# EasyEDA schematic Project Espro.json
TITLE: Project Espro; REV: 1.0; Date: 2024-11-20; Sheet: 1/1; Drawn By: Keven Hu; Company: Keven Hu
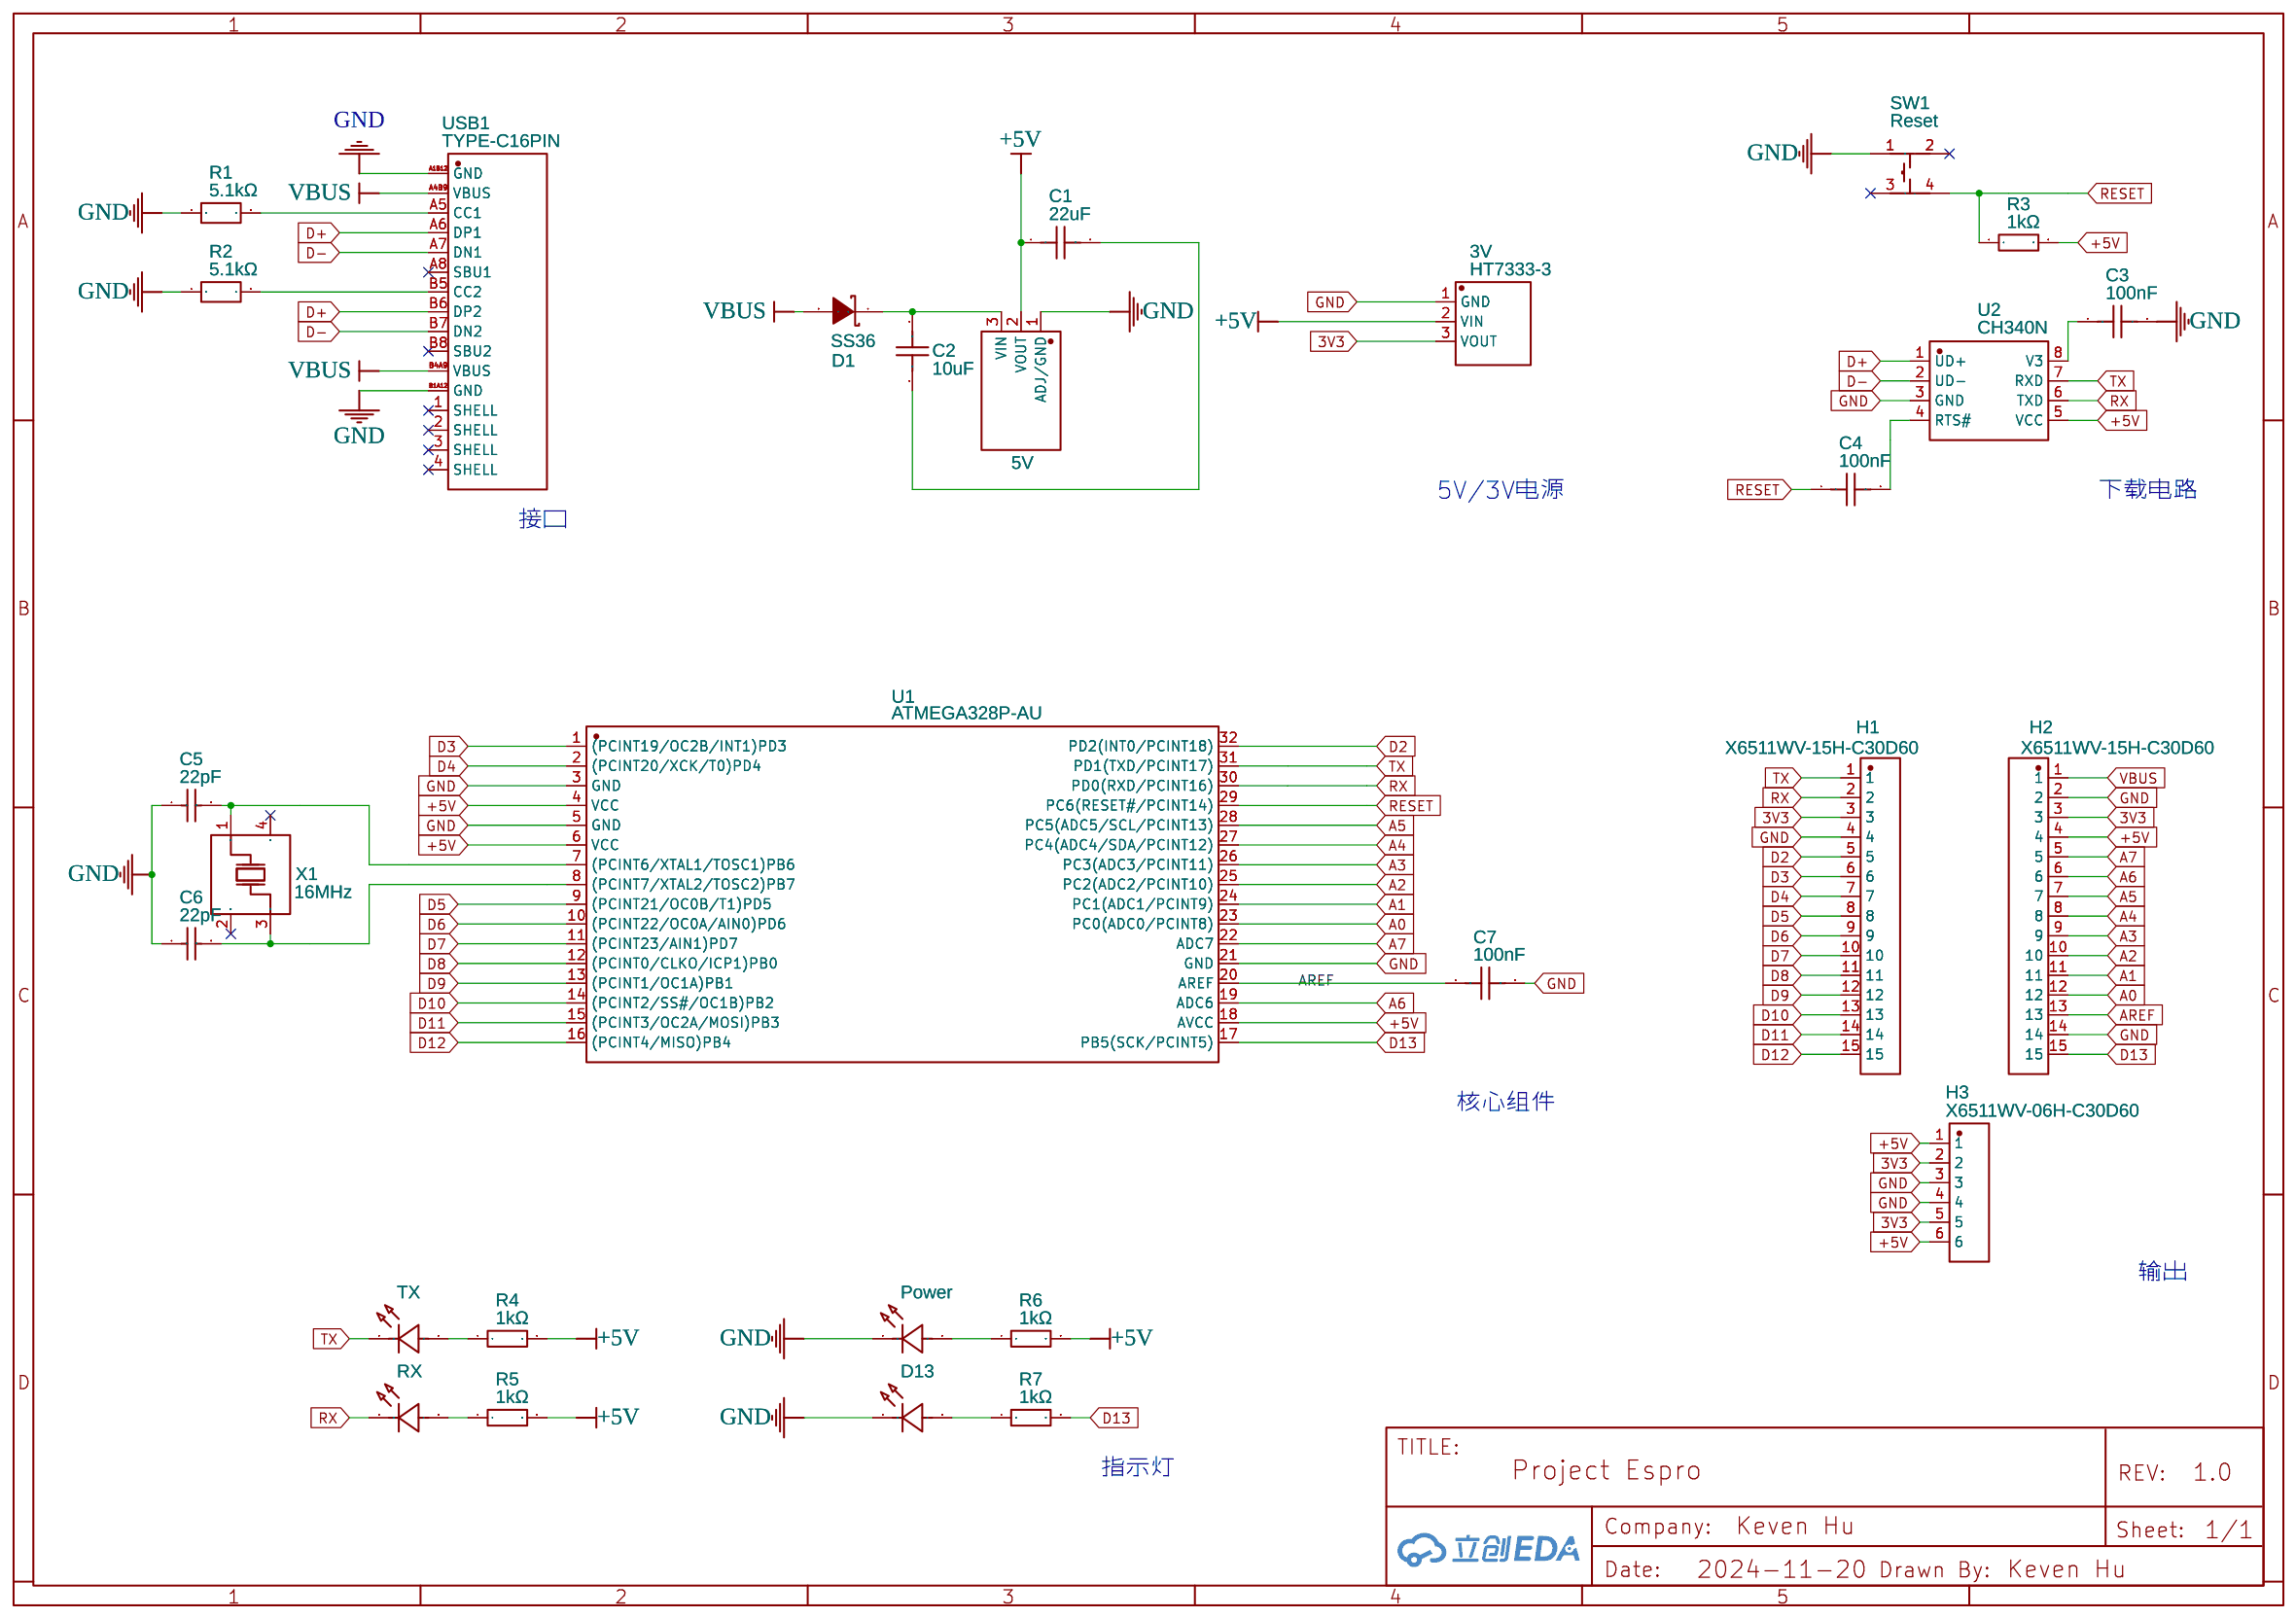
[diagram p0: schematic sheet]

## Parts
3V  HT7333-3  [SOT-89-3_L4.5-W2.5-P1.50-LS4.2-BR]
5V  5V  [SOT-89-3_L4.5-W2.5-P1.50-LS4.2-BR]
C1  22uF  [C0603]
C2  10uF  [C0603]
C3  100nF  [C0603]
C4  100nF  [C0603]
C5  22pF  [C0603]
C6  22pF  [C0603]
C7  100nF  [C0603]
D1  SS36  [SMA_L4.3-W2.6-LS5.2-RD]
H1  X6511WV-15H-C30D60  [HDR-TH_15P-P2.54-V-M]
H2  X6511WV-15H-C30D60  [HDR-TH_15P-P2.54-V-M]
H3  X6511WV-06H-C30D60  [HDR-TH_6P-P2.54-V-M]
LED1  TX  [LED0603-RD_1]
LED2  RX  [LED0603-RD_1]
LED3  Power  [LED0603-RD_1]
LED4  D13  [LED0603-RD_1]
R1  5.1kΩ  [R0603]
R2  5.1kΩ  [R0603]
R3  1kΩ  [R0603]
R4  1kΩ  [R0603]
R5  1kΩ  [R0603]
R6  1kΩ  [R0603]
R7  1kΩ  [R0603]
SW1  Reset  [SW-SMD_4P-L4.2-W3.2-P2.15-LS4.6-1]
U1  ATMEGA328P-AU  [TQFP-32_L7.0-W7.0-P0.80-LS9.0-BL]
U2  CH340N  [SOP-8_L5.0-W4.0-P1.27-LS6.0-BL]
USB1  TYPE-C16PIN  [USB-C-SMD_TYPE-C16PIN]
X1  16MHz  [OSC-SMD_4P-L3.2-W2.5-BL]

## Library data of the parts
3V = HT7333-3: Supplier: LCSC; Manufacturer: HOLTEK; Supplier Part: C84207; Paste Type: recommend
5V = AMS1117-5.0_C880753: Contributor: LCSC; Supplier: LCSC; Supplier Part: C880753; Manufacturer: Slkor(萨科微); Manufacturer Part: AMS1117-5.0; JLCPCB Part Class: Extended Part
C1 = HGC0603R5226M100NTHJ: Supplier: LCSC; Supplier Part: C7432770; Manufacturer: Chinocera(华瓷); JLCPCB Part Class: Extended Part; Contributor: lcsc
C2 = CGA0603X5R106K100JT: Supplier: LCSC; Supplier Part: C6119842; Manufacturer: HRE(芯声); Contributor: lcsc; JLCPCB Part Class: Extended Part
C3 C4 C7 = CGA0603X7R104K500JT: Supplier: LCSC; Supplier Part: C6119867; Manufacturer: HRE(芯声); JLCPCB Part Class: Extended Part; Contributor: lcsc
C5 C6 = CC0603JRNPO9BN220: Supplier: LCSC; Manufacturer: YAGEO(国巨); Supplier Part: C105620; JLCPCB Part Class: Extended Part
D1 = SS36: Supplier: LCSC; Manufacturer: MDD; image: //image.lceda.cn/szlcsc/C16015.jpg; Supplier Part: C16015; Paste Type: expand; Assembly Type: smtWeld
H1 H2 = X6511WV-15H-C30D60: Supplier: LCSC; Supplier Part: C725947; Manufacturer: XKB Connectivity; Contributor: LCSC; JLCPCB Part Class: Extended Part
H3 = X6511WV-06H-C30D60: Supplier: LCSC; Supplier Part: C706878; Manufacturer: XKB Connectivity; Contributor: LCSC; JLCPCB Part Class: Extended Part
LED1-LED4 = XL-1608UWC-06A: Supplier: LCSC; Supplier Part: C7371902; Manufacturer: XINGLIGHT(成兴光); JLCPCB Part Class: Extended Part; Contributor: lcsc
R1 R2 = FRC0603F5101TS: Contributor: lcsc; Supplier: LCSC; Supplier Part: C2907044; Manufacturer: FOJAN(富捷); JLCPCB Part Class: Extended Part
R3-R7 = RC0603FR-071KL: Supplier: LCSC; Manufacturer: YAGEO(国巨); Supplier Part: C22548; JLCPCB Part Class: Extended Part
SW1 = TS3425BA: Contributor: LCSC; Supplier: LCSC; Supplier Part: C2681476; Manufacturer: SHOU HAN(首韩); JLCPCB Part Class: Extended Part
U1 = ATMEGA328P-AU: Supplier: LCSC; Manufacturer: MICROCHIP; image: //image.lceda.cn/szlcsc/C14877.jpg; Supplier Part: C14877; Paste Type: base; Assembly Type: smtWeld
U2 = CH340N: Supplier: LCSC; Supplier Part: C506813; Manufacturer: WCH(Jiangsu Qin Heng); Contributor: LCSC; Paste Type: expand; Assembly Type: smtWeld
USB1 = TYPE-C16PIN: Supplier: LCSC; Supplier Part: C393939; Manufacturer: SHOU HAN; Contributor: LCSC
X1 = X322516MLB4SI: Supplier: LCSC; Manufacturer: YXC; Supplier Part: C13738; Paste Type: base; Assembly Type: smtWeld

## Nets
3V3: 3V.3(VOUT) H1.3 H2.3 H3.2 H3.5
+5V: 3V.2(VIN) 5V.2(VOUT) C1.1 H2.4 H3.1 H3.6 R3.2 R4.2 R5.2 R6.2 U1.4(VCC) U1.6(VCC) U1.18(AVCC) U2.5(VCC)
GND: 3V.1(GND) 5V.1(ADJ/GND) C3.2 C5.1 C6.1 C7.2 H1.4 H2.2 H2.14 H3.3 H3.4 LED3.1(K) LED4.1(K) R1.1 R2.1 SW1.1 U1.3(GND) U1.5(GND) U1.21(GND) U2.3(GND) USB1.A1B12(GND) USB1.B1A12(GND)
VBUS: D1.2(A) H2.1 USB1.A4B9(VBUS) USB1.B4A9(VBUS)
A0: H2.12 U1.23(PC0(ADC0/PCINT8))
A1: H2.11 U1.24(PC1(ADC1/PCINT9))
A2: H2.10 U1.25(PC2(ADC2/PCINT10))
A3: H2.9 U1.26(PC3(ADC3/PCINT11))
A4: H2.8 U1.27(PC4(ADC4/SDA/PCINT12))
A5: H2.7 U1.28(PC5(ADC5/SCL/PCINT13))
A6: H2.6 U1.19(ADC6)
A7: H2.5 U1.22(ADC7)
AREF: C7.1 H2.13 U1.20(AREF)
D2: H1.5 U1.32(PD2(INT0/PCINT18))
D3: H1.6 U1.1((PCINT19/OC2B/INT1)PD3)
D4: H1.7 U1.2((PCINT20/XCK/T0)PD4)
D5: H1.8 U1.9((PCINT21/OC0B/T1)PD5)
D6: H1.9 U1.10((PCINT22/OC0A/AIN0)PD6)
D7: H1.10 U1.11((PCINT23/AIN1)PD7)
D8: H1.11 U1.12((PCINT0/CLKO/ICP1)PB0)
D9: H1.12 U1.13((PCINT1/OC1A)PB1)
D10: H1.13 U1.14((PCINT2/SS#/OC1B)PB2)
D11: H1.14 U1.15((PCINT3/OC2A/MOSI)PB3)
D12: H1.15 U1.16((PCINT4/MISO)PB4)
D13: H2.15 R7.2 U1.17(PB5(SCK/PCINT5))
D+: U2.1(UD+) USB1.A6(DP1) USB1.B6(DP2)
D-: U2.2(UD-) USB1.A7(DN1) USB1.B7(DN2)
RESET: C4.1 R3.1 SW1.4 U1.29(PC6(RESET#/PCINT14))
RX: H1.2 LED2.1(K) U1.30(PD0(RXD/PCINT16)) U2.6(TXD)
TX: H1.1 LED1.1(K) U1.31(PD1(TXD/PCINT17)) U2.7(RXD)
Net-(5V-3): 5V.3(VIN) C2.1 D1.1(K)
Net-(C1-2): C1.2 C2.2
Net-(C3-1): C3.1 U2.8(V3)
Net-(C4-2): C4.2 U2.4(RTS#)
Net-(C5-2): C5.2 U1.7((PCINT6/XTAL1/TOSC1)PB6) X1.1(OSC1)
Net-(C6-2): C6.2 U1.8((PCINT7/XTAL2/TOSC2)PB7) X1.3(OSC2)
Net-(LED1-2): LED1.2(A) R4.1
Net-(LED2-2): LED2.2(A) R5.1
Net-(LED3-2): LED3.2(A) R6.1
Net-(LED4-2): LED4.2(A) R7.1
Net-(R1-2): R1.2 USB1.A5(CC1)
Net-(R2-2): R2.2 USB1.B5(CC2)

Not connected (* = marked no-connect by the designer): SW1 2* 3*; USB1 1(SHELL)* 2(SHELL)* 3(SHELL)* 4(SHELL)* A8(SBU1)* B8(SBU2)*; X1 2(GND)* 4(GND)*

## Notes on the sheet
- 5V/3V电源
- 下载电路
- 接口
- 核心组件
- 输出
- 指示灯
